# Altium project PCB_STM32F429_18Bit.PrjPCB
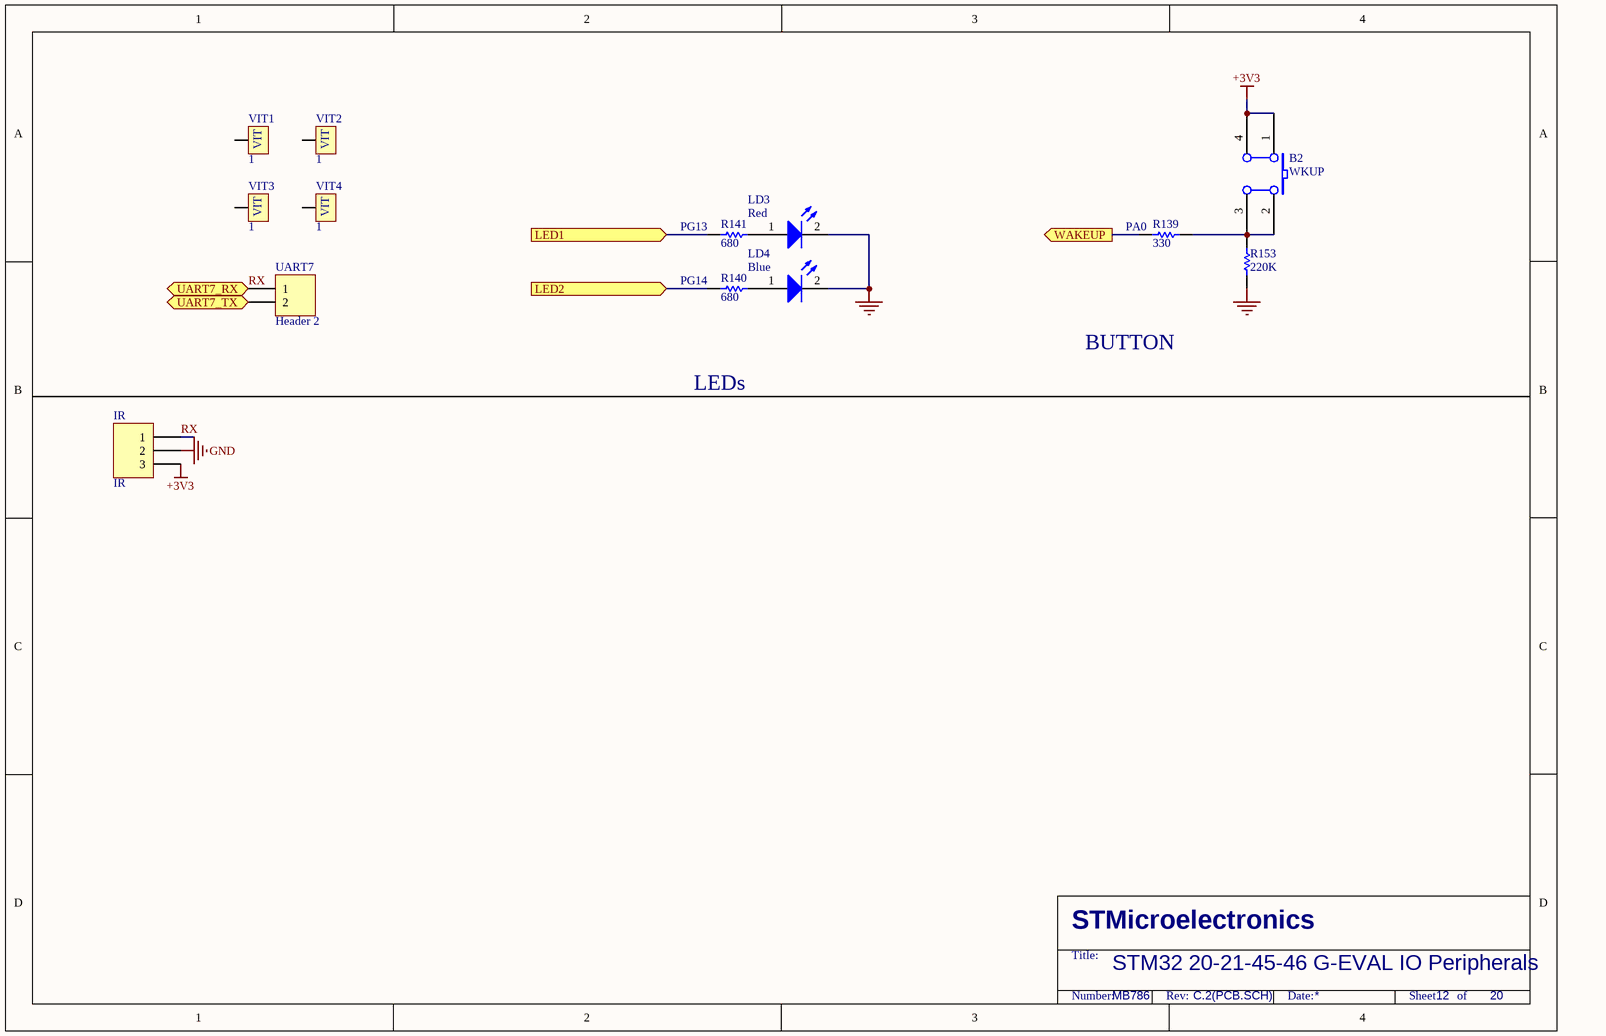
[diagram p0: IO Peripherals.SchDoc]
5 sheets, 43 parts. Net scope: flat (ports and power ports of the same name join across sheets).
Board file: STM32F429_18Bit_20_09.PcbDoc
Sheets:
  IO Peripherals.SchDoc
  LCD.SchDoc
  Memory.SchDoc
  power.SchDoc
  Camera.SchDoc

## Sheet IO Peripherals.SchDoc
size A4; Revision: C.2(PCB.SCH)

### Parts
B2  WKUP  [PB]
IR  IR  [HDR1X3]
LD3  Red  [0805_LED]
LD4  Blue  [0805_LED]
R139  330  [0603_R]
R140  680  [0603_R]
R141  680  [0603_R]
R153  220K  [0603_R]
UART7  Header 2  [HDR1X2]
VIT1  1  [VIT]
VIT2  1  [VIT]
VIT3  1  [VIT]
VIT4  1  [VIT]

### Ports
LED1 (in), LED2 (in), UART7_RX, UART7_TX, WAKEUP (out)

### Nets
+3V3: B2.1(A0) B2.4(A1) IR.3
GND: IR.2 LD3.2(K) LD4.2(K) R153.2
RX: IR.1 UART7.1 ; port UART7_RX
NetB2_2: B2.2(B0) B2.3(B1) R139.1 R153.1
NetLD3_1: LD3.1(A) R141.1
NetLD4_1: LD4.1(A) R140.1
NetR139_2: R139.2 ; port WAKEUP
NetR140_2: R140.2 ; port LED2
NetR141_2: R141.2 ; port LED1
NetUART7_2: UART7.2 ; port UART7_TX

Not connected (* = marked no-connect by the designer): VIT1 VIT1(1); VIT2 VIT1(1); VIT3 VIT1(1); VIT4 VIT1(1)

### Notes on the sheet
- (near R141) PG13
- (near R139) PA0
- (near R140) PG14
- BUTTON
- LEDs
- STM32 20-21-45-46 G-EVAL IO Peripherals
- MB786
- 12
- 20
- STMicroelectronics
- Title:
- Number:
- Rev:
- Date:
- Sheet       of

### Library data of the parts
B2 = SW PUSHBUTTON: SE PUSHBUTTON
IR = Header 3: Header, 3-Pin; LatestRevisionDate: 17-Jul-2002; LatestRevisionNote: Re-released for DXP Platform.; Publisher: Altium Limited
LD3 LD4 = LED2: Typical RED, GREEN, YELLOW, AMBER GaAs LED; Published: 8-Jun-2000; Revision: July-2002: Re-released for DXP Platform.; Publisher: Altium Limited
R139-R141 = Res1: Resistor; Value: 1K; Published: 8-Jun-2000; Revision: July-2002: Re-released for DXP Platform.; Publisher: Altium Limited
R153 = res1: Resistor; Value: 1K; Published: 8-Jun-2000; Revision: July-2002: Re-released for DXP Platform.; Publisher: Altium Limited
UART7 = Header 2: Header, 2-Pin; LatestRevisionDate: 17-Jul-2002; LatestRevisionNote: Re-released for DXP Platform.; Publisher: Altium Limited
VIT1-VIT4 = VIT: Oc Vit

## Sheet LCD.SchDoc
size A4; Revision: C.2(PCB.SCH)
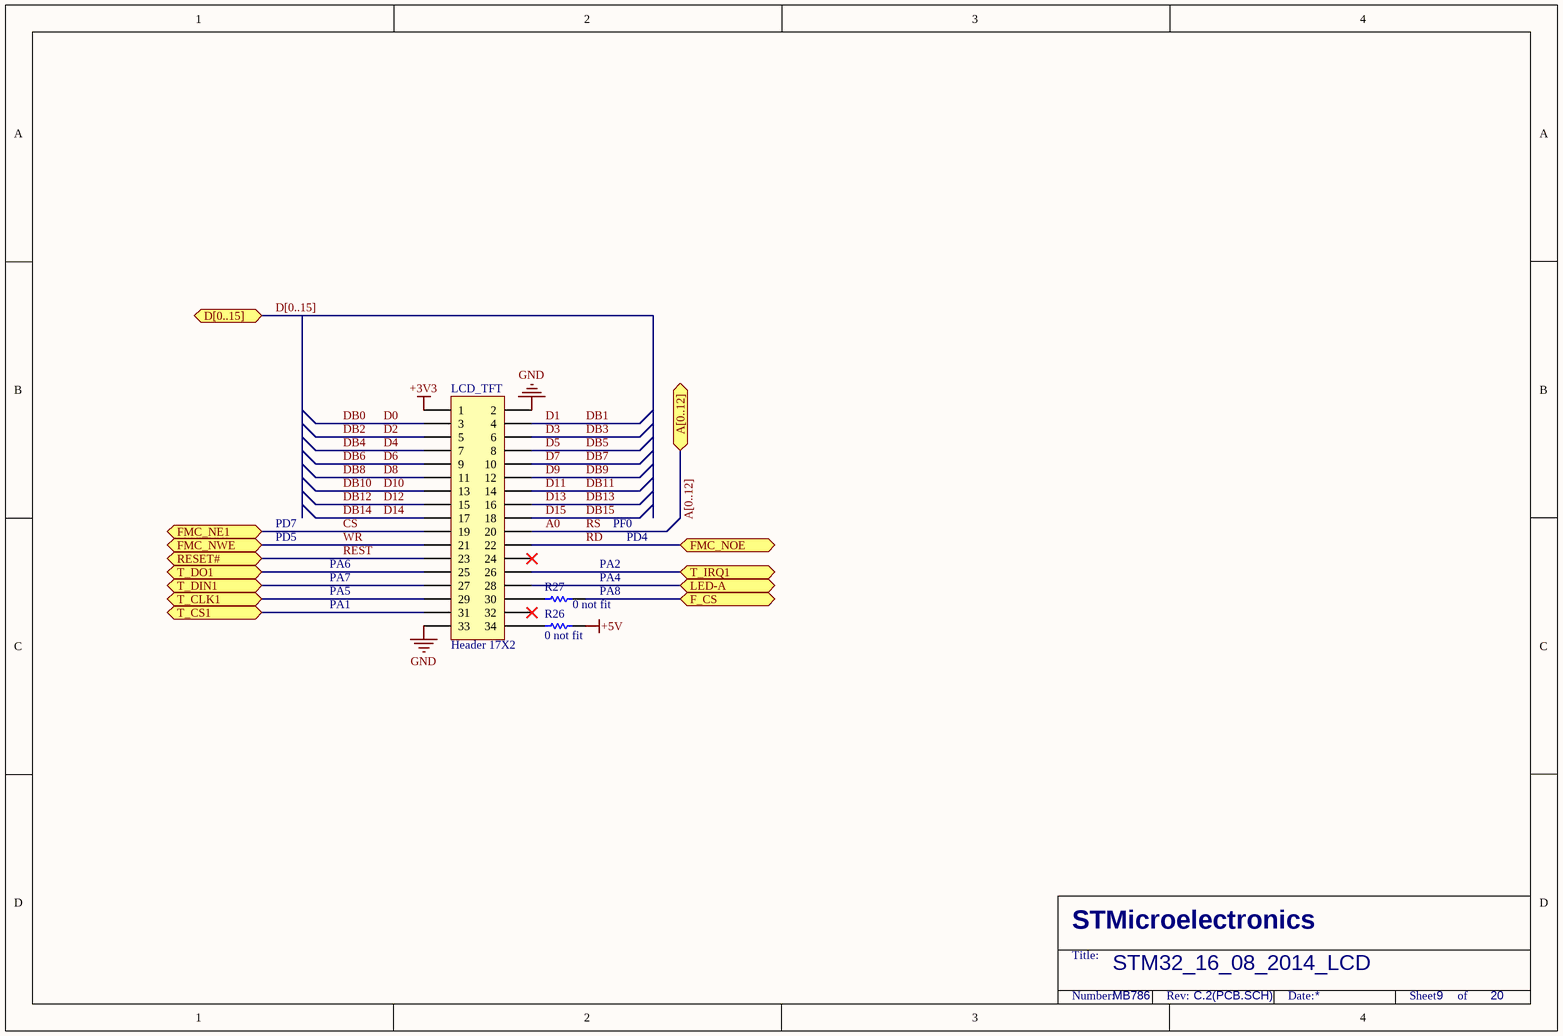
[diagram p1: LCD.SchDoc]

### Parts
LCD_TFT  Header 17X2  [HDR2X17]
R26  0 not fit  [0603_R]
R27  0 not fit  [0603_R]

### Ports
A[0..12], D[0..15], F_CS, FMC_NE1, FMC_NOE, FMC_NWE, LED-A, RESET#, T_CLK1, T_CS1, T_DIN1, T_DO1, T_IRQ1

### Nets
+3V3: LCD_TFT.1
+5V: R26.1
GND: LCD_TFT.2 LCD_TFT.33
A0: LCD_TFT.20  [also labelled RS]
CS: LCD_TFT.19 ; port FMC_NE1
D0: LCD_TFT.3  [also labelled DB0]
D1: LCD_TFT.4  [also labelled DB1]
D2: LCD_TFT.5  [also labelled DB2]
D3: LCD_TFT.6  [also labelled DB3]
D4: LCD_TFT.7  [also labelled DB4]
D5: LCD_TFT.8  [also labelled DB5]
D6: LCD_TFT.9  [also labelled DB6]
D7: LCD_TFT.10  [also labelled DB7]
D8: LCD_TFT.11  [also labelled DB8]
D9: LCD_TFT.12  [also labelled DB9]
D10: LCD_TFT.13  [also labelled DB10]
D11: LCD_TFT.14  [also labelled DB11]
D12: LCD_TFT.15  [also labelled DB12]
D13: LCD_TFT.16  [also labelled DB13]
D14: LCD_TFT.17  [also labelled DB14]
D15: LCD_TFT.18  [also labelled DB15]
RD: LCD_TFT.22 ; port FMC_NOE
REST: LCD_TFT.23 ; port RESET#
WR: LCD_TFT.21 ; port FMC_NWE
NetLCD_TFT_25: LCD_TFT.25 ; port T_DO1
NetLCD_TFT_26: LCD_TFT.26 ; port T_IRQ1
NetLCD_TFT_27: LCD_TFT.27 ; port T_DIN1
NetLCD_TFT_28: LCD_TFT.28 ; port LED-A
NetLCD_TFT_29: LCD_TFT.29 ; port T_CLK1
NetLCD_TFT_30: LCD_TFT.30 R27.2
NetLCD_TFT_31: LCD_TFT.31 ; port T_CS1
NetLCD_TFT_34: LCD_TFT.34 R26.2
NetR27_1: R27.1 ; port F_CS

Not connected (* = marked no-connect by the designer): LCD_TFT 24* 32*

### Buses and harness runs
bus A[0..12] = port A[0..12]
bus D[0..15] = port D[0..15]

### Notes on the sheet
- PD7
- PD5
- PA6
- PA7
- PA2
- PA4
- PF0
- PD4
- PA5
- PA1
- PA8
- STM32_16_08_2014_LCD
- MB786
- 9
- 20
- STMicroelectronics
- Title:
- Number:
- Rev:
- Date:
- Sheet       of

### Library data of the parts
LCD_TFT = Header 17X2: Header, 17-Pin, Dual row; LatestRevisionDate: 17-Jul-2002; LatestRevisionNote: Re-released for DXP Platform.; Publisher: Altium Limited
R26 R27 = Res1: Resistor; Value: 1K; Published: 8-Jun-2000; LatestRevisionDate: 17-Jul-2002; LatestRevisionNote: Re-released for DXP Platform.; PackageReference: AXIAL-0.3; Publisher: Altium Limited; PackageDescription: Axial Device, Thru-Hole; 2 Leads; 0.3 in Pin Spacing

## Sheet Memory.SchDoc
size A3
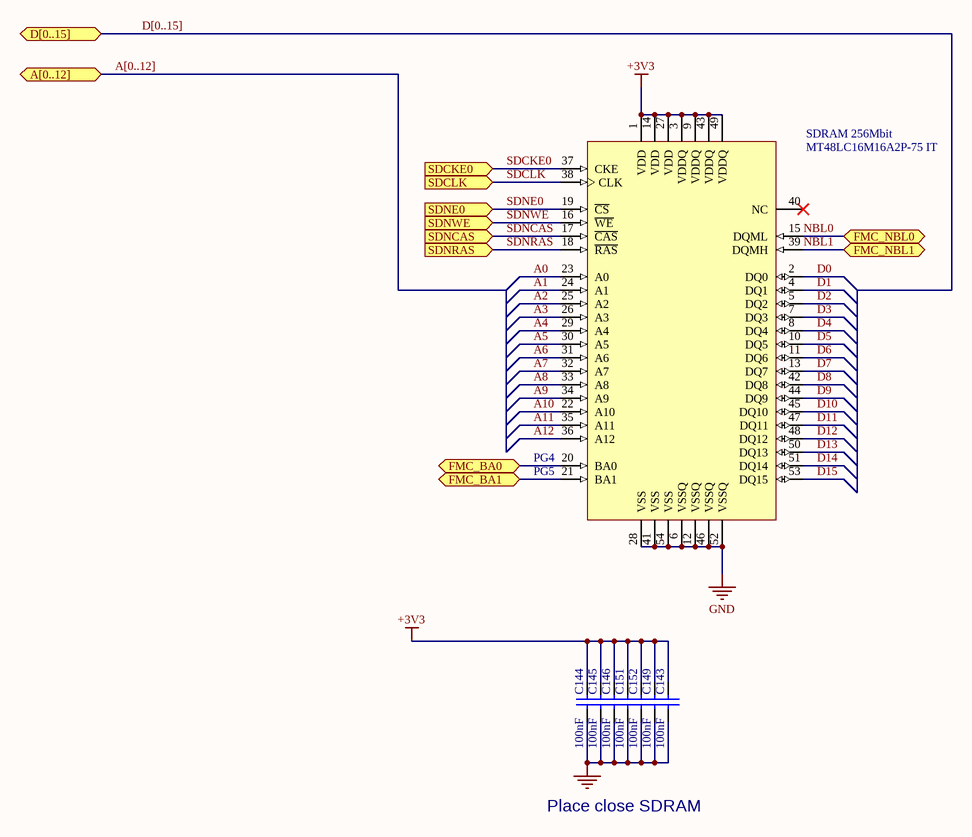
[diagram p2: Memory.SchDoc]

### Parts
C143  100nF  [0603_C]
C144  100nF  [0603_C]
C145  100nF  [0603_C]
C146  100nF  [0603_C]
C149  100nF  [0603_C]
C151  100nF  [0603_C]
C152  100nF  [0603_C]
SDRAM_256Mbit  MT48LC16M16A2P-75 IT  [TSOP2-54_N]

### Ports
A[0..12], D[0..15], FMC_BA0, FMC_BA1, FMC_NBL0, FMC_NBL1, SDCKE0 (in), SDCLK (in), SDNCAS (in), SDNE0 (in), SDNRAS (in), SDNWE (in)

### Nets
+3V3: C143.1 C144.1 C145.1 C146.1 C149.1 C151.1 C152.1 SDRAM_256Mbit.1(VDD) SDRAM_256Mbit.3(VDDQ) SDRAM_256Mbit.9(VDDQ) SDRAM_256Mbit.14(VDD) SDRAM_256Mbit.27(VDD) SDRAM_256Mbit.43(VDDQ) SDRAM_256Mbit.49(VDDQ)
GND: C143.2 C144.2 C145.2 C146.2 C149.2 C151.2 C152.2 SDRAM_256Mbit.6(VSSQ) SDRAM_256Mbit.12(VSSQ) SDRAM_256Mbit.28(VSS) SDRAM_256Mbit.41(VSS) SDRAM_256Mbit.46(VSSQ) SDRAM_256Mbit.52(VSSQ) SDRAM_256Mbit.54(VSS)
A0: SDRAM_256Mbit.23(A0)
A1: SDRAM_256Mbit.24(A1)
A2: SDRAM_256Mbit.25(A2)
A3: SDRAM_256Mbit.26(A3)
A4: SDRAM_256Mbit.29(A4)
A5: SDRAM_256Mbit.30(A5)
A6: SDRAM_256Mbit.31(A6)
A7: SDRAM_256Mbit.32(A7)
A8: SDRAM_256Mbit.33(A8)
A9: SDRAM_256Mbit.34(A9)
A10: SDRAM_256Mbit.22(A10)
A11: SDRAM_256Mbit.35(A11)
A12: SDRAM_256Mbit.36(A12)
D0: SDRAM_256Mbit.2(DQ0)
D1: SDRAM_256Mbit.4(DQ1)
D2: SDRAM_256Mbit.5(DQ2)
D3: SDRAM_256Mbit.7(DQ3)
D4: SDRAM_256Mbit.8(DQ4)
D5: SDRAM_256Mbit.10(DQ5)
D6: SDRAM_256Mbit.11(DQ6)
D7: SDRAM_256Mbit.13(DQ7)
D8: SDRAM_256Mbit.42(DQ8)
D9: SDRAM_256Mbit.44(DQ9)
D10: SDRAM_256Mbit.45(DQ10)
D11: SDRAM_256Mbit.47(DQ11)
D12: SDRAM_256Mbit.48(DQ12)
D13: SDRAM_256Mbit.50(DQ13)
D14: SDRAM_256Mbit.51(DQ14)
D15: SDRAM_256Mbit.53(DQ15)
NBL0: SDRAM_256Mbit.15(DQML) ; port FMC_NBL0
NBL1: SDRAM_256Mbit.39(DQMH) ; port FMC_NBL1
SDCKE0: SDRAM_256Mbit.37(CKE) ; port SDCKE0
SDCLK: SDRAM_256Mbit.38(CLK) ; port SDCLK
SDNCAS: SDRAM_256Mbit.17(~{CAS}) ; port SDNCAS
SDNE0: SDRAM_256Mbit.19(~{CS}) ; port SDNE0
SDNRAS: SDRAM_256Mbit.18(~{RAS}) ; port SDNRAS
SDNWE: SDRAM_256Mbit.16(~{WE}) ; port SDNWE
NetSDRAM_256Mbit_20: SDRAM_256Mbit.20(BA0) ; port FMC_BA0
NetSDRAM_256Mbit_21: SDRAM_256Mbit.21(BA1) ; port FMC_BA1

Not connected (* = marked no-connect by the designer): SDRAM_256Mbit 40(NC)*

### Buses and harness runs
bus A[0..12] = port A[0..12]
bus D[0..15] = port D[0..15]

### Notes on the sheet
- (near SDRAM_256Mbit) PG4
- (near SDRAM_256Mbit) PG5
- Place close SDRAM

### Library data of the parts
C143-C146 C149 C151 C152 = Cap: Capacitor; Value: 10nF; Published: 8-Jun-2000; Revision: July-2002: Re-released for DXP Platform.; Publisher: Altium Limited
SDRAM_256Mbit = MT48LC16M16A2P-75 IT: 256Mb Synchronous High-Speed CMOS DRAM, 16Mb x 16Bit x 4 Banks, 54-Pin TSOP Pb-free, Industrial; CycleTime: 7.5ns @ CL = 3 (PC133); RowAddress: 8K (A0-A12); ColumnAddress: 512 (A0-A8); Published: 11-Oct-2004; LatestRevisionDate: 13-Apr-2006; LatestRevisionNote: IPC-7351 Footprint Added.; DatasheetVersion: RevL, Oct-2007; PackageVersion: Sep-2003; PackageReference: TSOP2-54; Publisher: Altium Limited; PackageDescription: 54-Pin Plastic Small Outline Package 0.8 mm Pitch; Code_JEDEC: MS-024-FA; ComponentLink1Description: Manufacturer Link; ComponentLink1URL: http://www.micron.com; ComponentLink2Description: Datasheet; ComponentLink2URL: http://download.micron.com/pdf/datasheets/dram/sdram/256MSDRAM.pdf

## Sheet power.SchDoc
size A4; Revision: C.2(PCB.SCH)
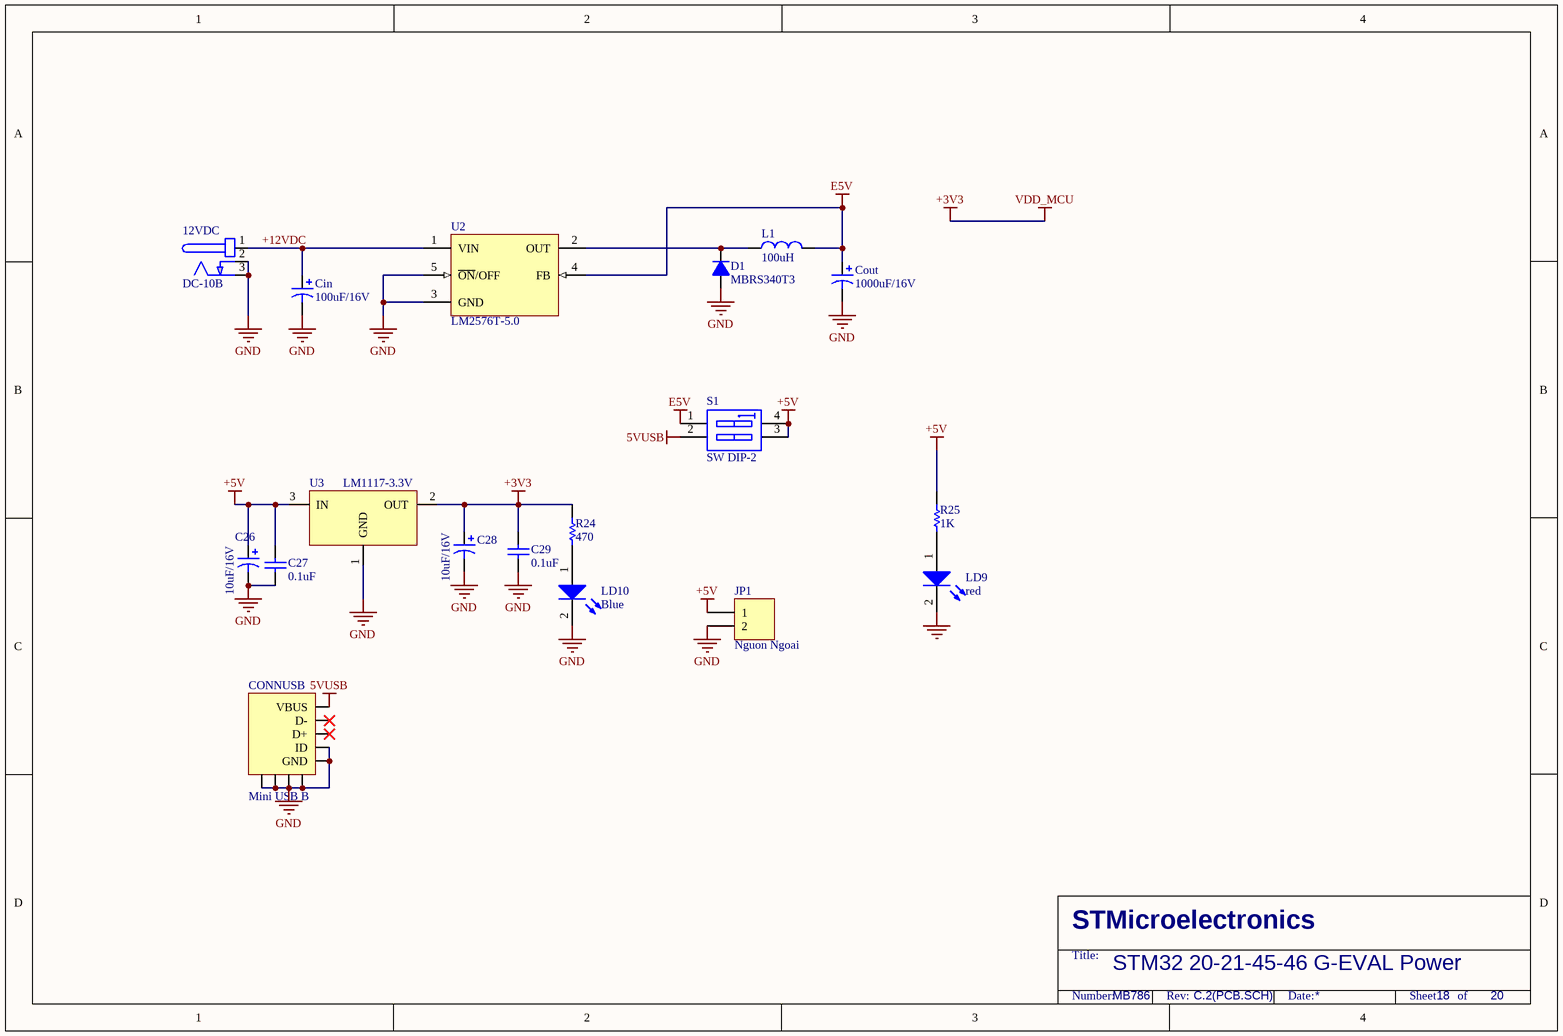
[diagram p3: power.SchDoc]

### Parts
12VDC  DC-10B  [DC IN]
C26  10uF/16V  [AVX-CAPC3528_V]
C27  0.1uF  [0603_C]
C28  10uF/16V  [AVX-CAPC3528_V]
C29  0.1uF  [0603_C]
Cin  100uF/16V  [CAPAE660X540N]
CONNUSB  Mini USB B  [USB MINI B RECEPTACLE]
Cout  1000uF/16V  [CAPAE1030X1020N]
D1  MBRS340T3  [DO-214AB]
JP1  Nguon Ngoai  [HDR1X2]
L1  100uH  [IND_BOURNS_PM127SH]
LD9  red  [0805_LED]
LD10  Blue  [0805_LED]
R24  470  [0603_R]
R25  1K  [0603_R]
S1  SW DIP-2  [SW_OMRON_A6S-2102-H]
U2  LM2576T-5.0  [TO263-5]
U3  LM1117-3.3V  [SOT223-4N]

### Nets
5VUSB: CONNUSB.1(VBUS) S1.2(A2)
+3V3: C28.1 C29.1 R24.2 U3.2(OUT)  [also labelled VDD_MCU]
+5V: C26.1 C27.1 JP1.1 R25.2 S1.3(B2) S1.4(B1) U3.3(IN)
E5V: Cout.1 L1.2 S1.1(A1) U2.4(FB)
GND: 12VDC.2(GND) 12VDC.3(GND) C26.2 C27.2 C28.2 C29.2 Cin.2 CONNUSB.4(ID) CONNUSB.5(GND) CONNUSB.SHIELD Cout.2 D1.1(A) JP1.2 LD9.2(K) LD10.2(K) U2.3(GND) U2.5(~{ON}/OFF) U3.1(GND)
+12VDC: 12VDC.1(+) Cin.1 U2.1(VIN)
NetD1_2: D1.2(K) L1.1 U2.2(OUT)
NetLD9_1: LD9.1(A) R25.1
NetLD10_1: LD10.1(A) R24.1

Not connected (* = marked no-connect by the designer): CONNUSB 2(D-)* 3(D+)*

### Notes on the sheet
- STM32 20-21-45-46 G-EVAL Power
- MB786
- 18
- 20
- STMicroelectronics
- Title:
- Number:
- Rev:
- Date:
- Sheet       of

### Library data of the parts
12VDC = PJ202A
C26 = AVX-CAP-P-2: Tu Hoa
C27 C29 = Cap: Capacitor; Value: 100pF; Published: 8-Jun-2000; LatestRevisionDate: 17-Jul-2002; LatestRevisionNote: Re-released for DXP Platform.; PackageReference: RAD-0.3; Publisher: Altium Limited; PackageDescription: Radial Cap, Thru-Hole; 2 Leads; 0.3 in Pin Spacing
C28 Cin Cout = AVX-CAP-P-2: Tu hoa
CONNUSB = 10033526-N3212LF: FCI Mini USB B Recptacle Right Angle; Supplier 1: Digi-Key; Supplier Part Number 1: 609-4700-1-ND; Value: Mini USB B
D1 = D1A: Diode 1A; Value: 1N4007
JP1 = Header 2: Header, 2-Pin; LatestRevisionDate: 17-Jul-2002; LatestRevisionNote: Re-released for DXP Platform.; Publisher: Altium Limited
L1 = L1: Inductor; Value: 150 mH
LD9 LD10 = LED2: as LD3 on sheet IO Peripherals; Published: 8-Jun-2000; Revision: July-2002: Re-released for DXP Platform.; Publisher: Altium Limited
R24 = res1: Resistor; Value: 1K; Published: 8-Jun-2000; Revision: July-2002: Re-released for DXP Platform.; Publisher: Altium Limited
R25 = res1: Resistor; Published: 8-Jun-2000; Revision: July-2002: Re-released for DXP Platform.; Publisher: Altium Limited; Value: 1K
S1 = SW DIP-2: DIP Switch, 2 Position, SPST; Published: 24-Mar-1999; LatestRevisionDate: 17-Jul-2002; LatestRevisionNote: Re-released for DXP Platform.; PackageReference: DIP-4; Publisher: Altium Limited
U2 = LM2576T-5.0: SIMPLE SWITCHER; 3A Step-Down Voltage Regulator; Manufacturer: National Semiconductor; PackageTopMarking: NSUZXYTT*LM2576T*-5.0 P+; PowerWise: N; FirstPublished: 4-Dec-2008; DatasheetVersion: Aug-2004; PackageVersion: revJ, Jan-1992; PackageReference: T05A; Publisher: Altium Limited; PackageDescription: TO-220, Molded, 5 Lead, Straight; CompType: Switcher; PartNumber: LM2576T-5.0; RoHS: O; PinCount: 5; DigiKeyPartNumber: LM2576T-5.0-ND; Code_JEDEC: TO-220-AB; ComponentLink1Description: LM2576 Datasheet; ComponentLink1URL: http://www.national.com/ds/LM/LM2576.pdf; ComponentLink2Description: LM2576 Web Page; ComponentLink2URL: http://www.national.com/pf/LM/LM2576.html; ComponentLink3Description: T05A Package Page; ComponentLink3URL: http://www.national.com/packaging/folders/t05a.html
U3 = LM1117: 800mA Low-Dropout Linear Regulator; Creator: Nguyen Ba Bien; Website: http://group3i.net

## Sheet Camera.SchDoc
size A
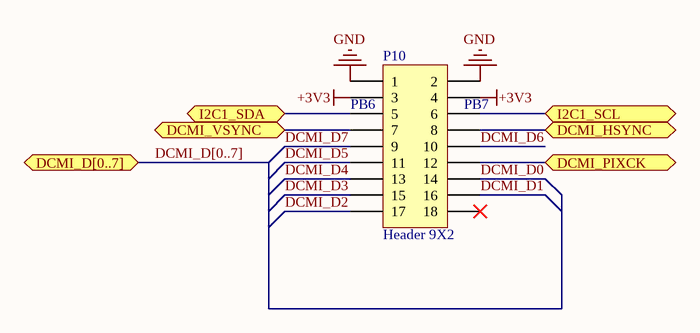
[diagram p4: Camera.SchDoc]

### Parts
P10  Header 9X2  [HDR2X9]

### Ports
DCMI_D[0..7], DCMI_HSYNC, DCMI_PIXCK, DCMI_VSYNC, I2C1_SCL, I2C1_SDA

### Nets
+3V3: P10.3 P10.4
GND: P10.1 P10.2
DCMI_D0: P10.14
DCMI_D1: P10.16
DCMI_D2: P10.17
DCMI_D3: P10.15
DCMI_D4: P10.13
DCMI_D5: P10.11
DCMI_D6: P10.10
DCMI_D7: P10.9
NetP10_5: P10.5 ; port I2C1_SDA
NetP10_6: P10.6 ; port I2C1_SCL
NetP10_7: P10.7 ; port DCMI_VSYNC
NetP10_8: P10.8 ; port DCMI_HSYNC
NetP10_12: P10.12 ; port DCMI_PIXCK

Not connected (* = marked no-connect by the designer): P10 18*

### Buses and harness runs
bus DCMI_D[0..7] = port DCMI_D[0..7]

### Notes on the sheet
- (near P10) PB6
- (near P10) PB7

### Library data of the parts
P10 = Header 9X2: Header, 9-Pin, Dual row; LatestRevisionDate: 17-Jul-2002; LatestRevisionNote: Re-released for DXP Platform.; Publisher: Altium Limited

## Nets that join several sheets
+3V3: IO Peripherals (B2.1 B2.4 IR.3), LCD (LCD_TFT.1), Memory (14 pins), power (C28.1 C29.1 R24.2 U3.2), Camera (P10.3 P10.4)
+5V: LCD (R26.1), power (7 pins)
GND: IO Peripherals (IR.2 LD3.2 LD4.2 R153.2), LCD (LCD_TFT.2 LCD_TFT.33), Memory (14 pins), power (18 pins), Camera (P10.1 P10.2)
A0: LCD (LCD_TFT.20), Memory (SDRAM_256Mbit.23)
D0: LCD (LCD_TFT.3), Memory (SDRAM_256Mbit.2)
D1: LCD (LCD_TFT.4), Memory (SDRAM_256Mbit.4)
D2: LCD (LCD_TFT.5), Memory (SDRAM_256Mbit.5)
D3: LCD (LCD_TFT.6), Memory (SDRAM_256Mbit.7)
D4: LCD (LCD_TFT.7), Memory (SDRAM_256Mbit.8)
D5: LCD (LCD_TFT.8), Memory (SDRAM_256Mbit.10)
D6: LCD (LCD_TFT.9), Memory (SDRAM_256Mbit.11)
D7: LCD (LCD_TFT.10), Memory (SDRAM_256Mbit.13)
D8: LCD (LCD_TFT.11), Memory (SDRAM_256Mbit.42)
D9: LCD (LCD_TFT.12), Memory (SDRAM_256Mbit.44)
D10: LCD (LCD_TFT.13), Memory (SDRAM_256Mbit.45)
D11: LCD (LCD_TFT.14), Memory (SDRAM_256Mbit.47)
D12: LCD (LCD_TFT.15), Memory (SDRAM_256Mbit.48)
D13: LCD (LCD_TFT.16), Memory (SDRAM_256Mbit.50)
D14: LCD (LCD_TFT.17), Memory (SDRAM_256Mbit.51)
D15: LCD (LCD_TFT.18), Memory (SDRAM_256Mbit.53)